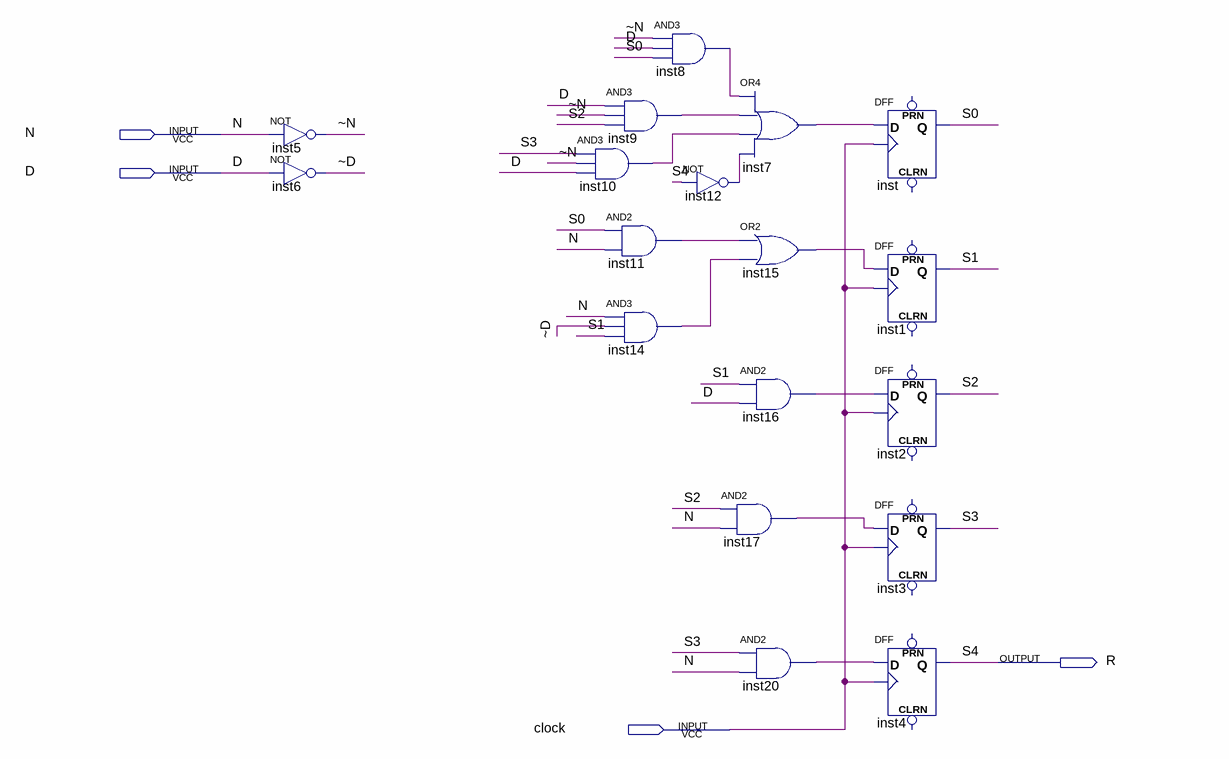
[diagram p0: schematic sheet]
// Quartus schematic hot.bdf as structural Verilog: 18 symbols, 4 pins
module hot (
  input  N,
  input  D,
  input  clock,
  output R
);

  wire inst7_out, inst8_out, inst9_out, inst10_out, inst11_out, inst12_out, inst14_out, inst15_out,
       inst16_out, inst17_out, inst20_out, S0, S1, S2, S3, \~D , \~N ;

  not inst5 (\~N , N);
  not inst6 (\~D , D);
  and inst10 (inst10_out, S3, \~N , D);
  and inst8 (inst8_out, \~N , D, S0);
  and inst9 (inst9_out, D, \~N , S2);
  and inst11 (inst11_out, S0, N);
  and inst14 (inst14_out, N, \~D , S1);
  or inst7 (inst7_out, inst8_out, inst9_out, inst10_out, inst12_out);
  not inst12 (inst12_out, R);
  or inst15 (inst15_out, inst11_out, inst14_out);
  and inst16 (inst16_out, S1, D);
  and inst17 (inst17_out, S2, N);
  and inst20 (inst20_out, S3, N);
  DFF inst (.CLK(clock), .D(inst7_out), .Q(S0));  // open: CLRN, PRN
  DFF inst1 (.CLK(clock), .D(inst15_out), .Q(S1));  // open: CLRN, PRN
  DFF inst2 (.CLK(clock), .D(inst16_out), .Q(S2));  // open: CLRN, PRN
  DFF inst3 (.CLK(clock), .D(inst17_out), .Q(S3));  // open: CLRN, PRN
  DFF inst4 (.CLK(clock), .D(inst20_out), .Q(R));  // open: CLRN, PRN

  // Other names for the same wires on the sheet: S4 = R
endmodule
